# EAGLE schematic base-module-r1_MI_1 (EAGLE 5.12)
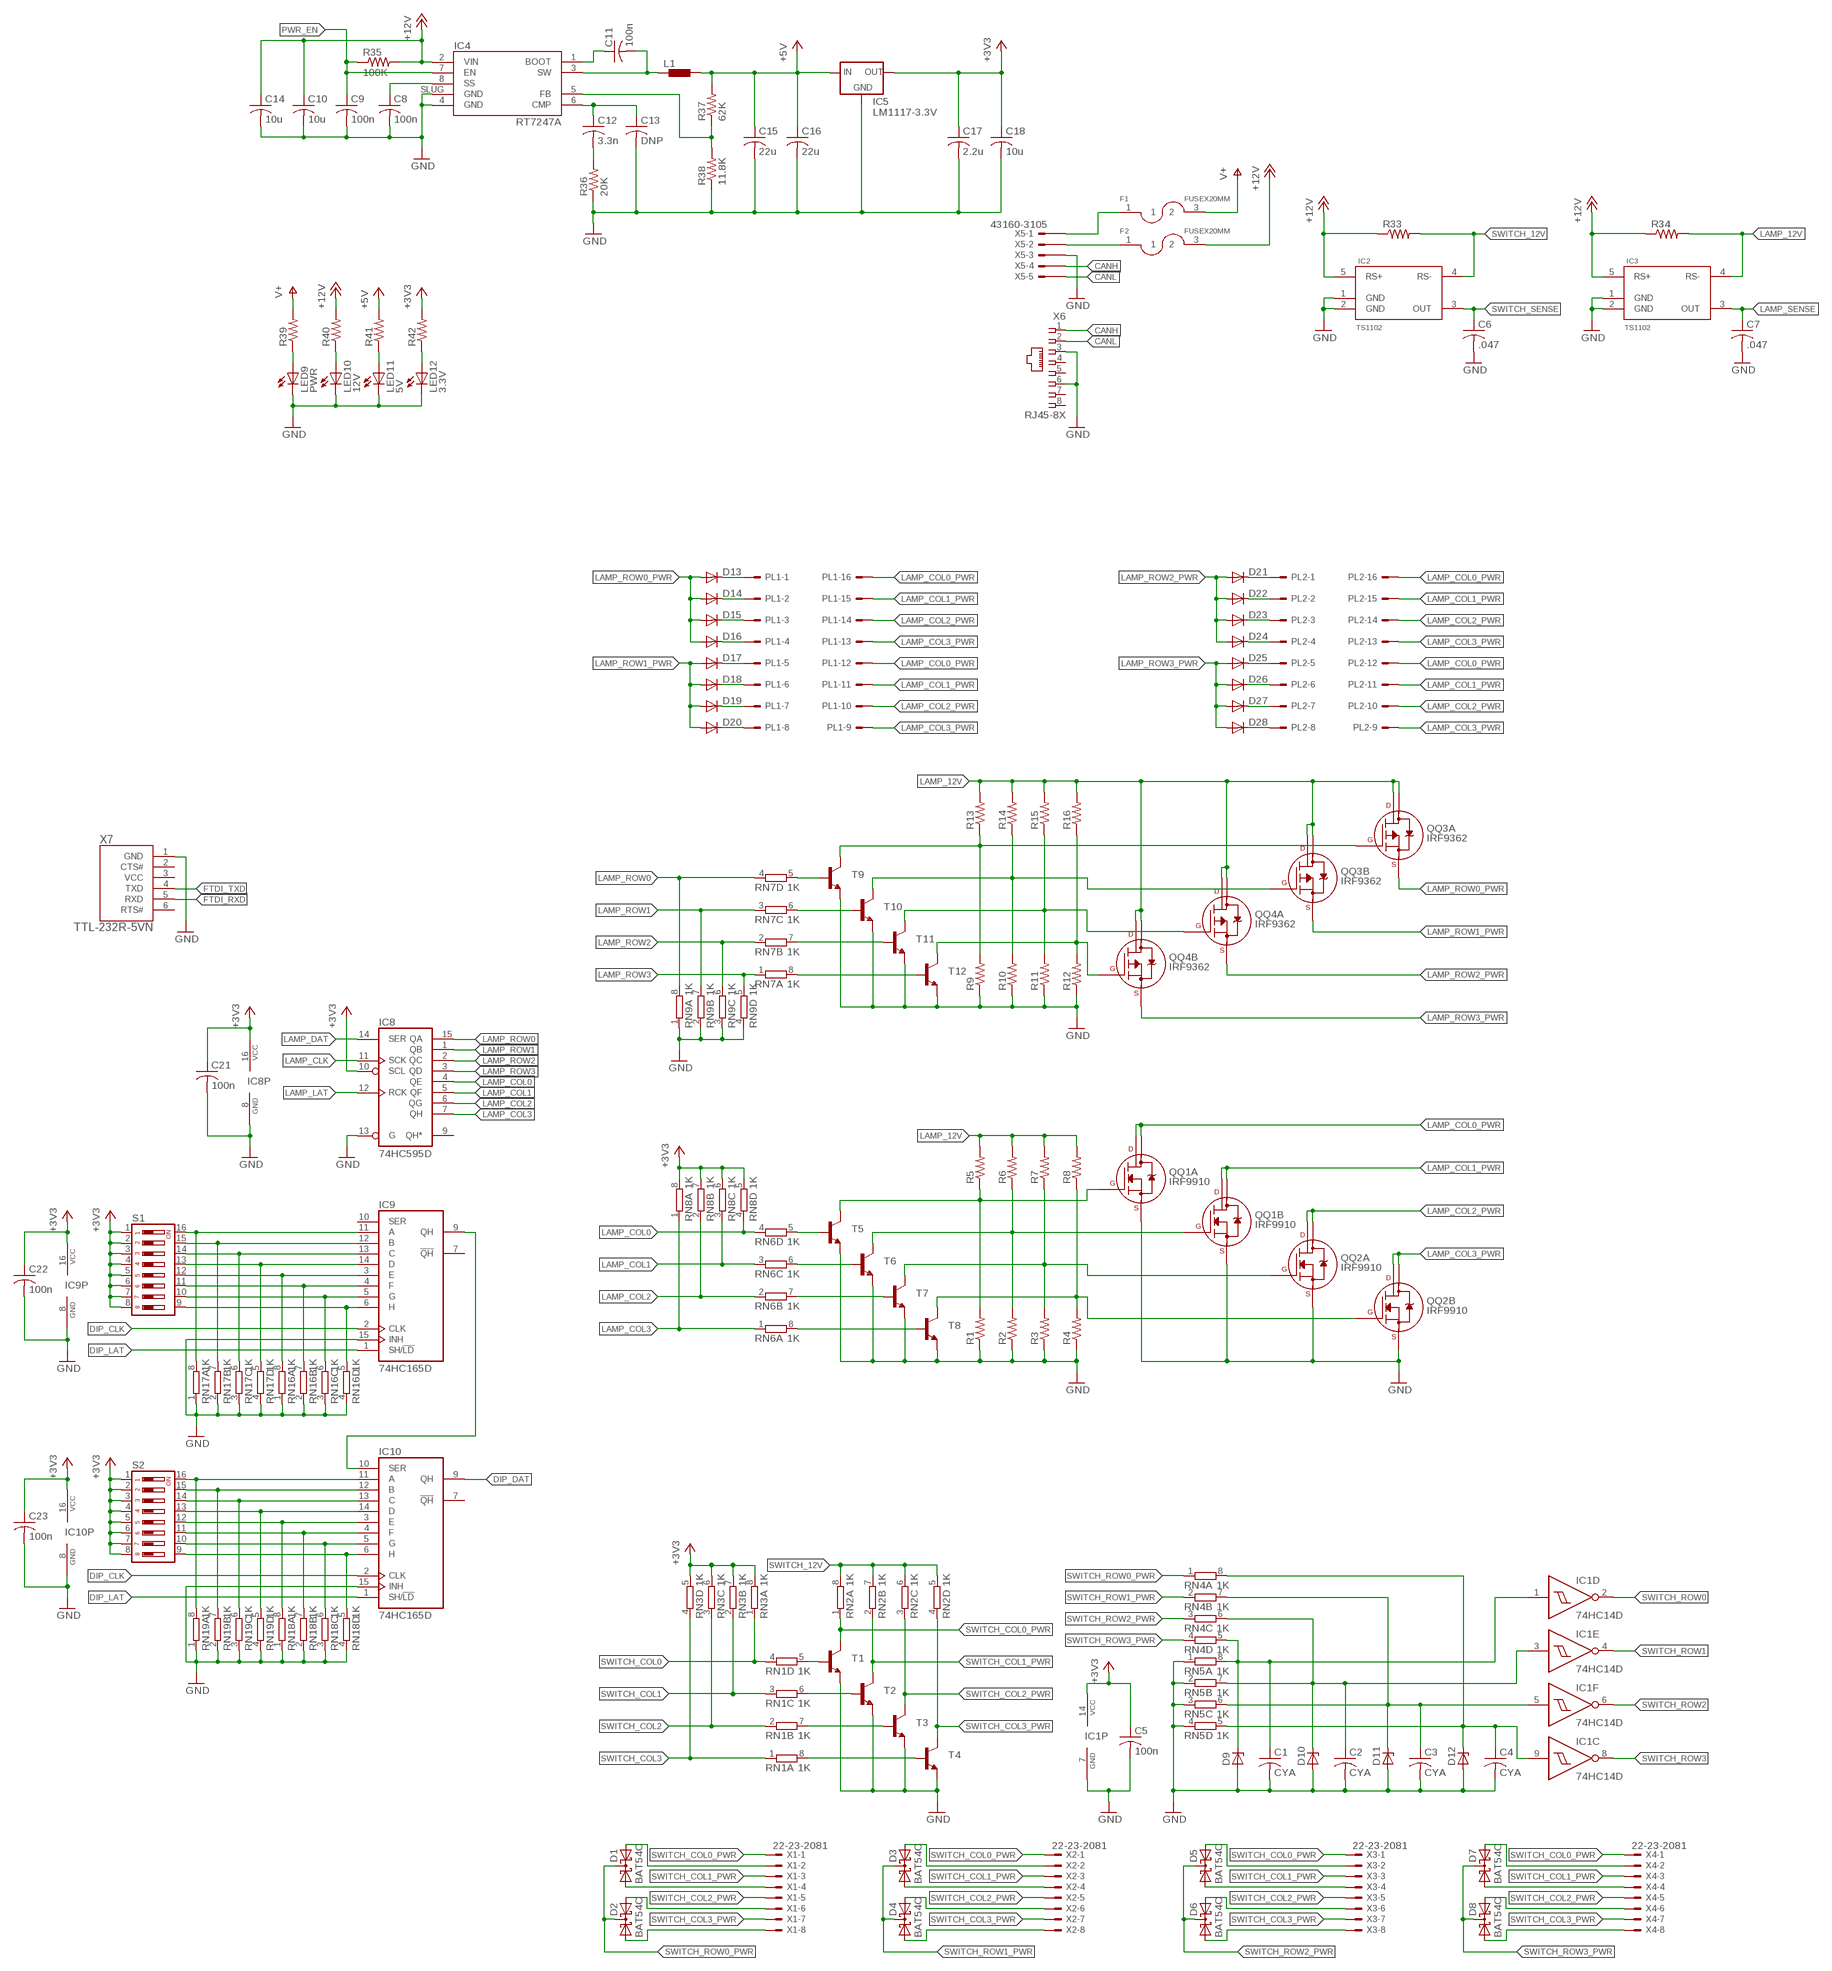
[diagram p0: schematic, sheet 1, part 1 of 3]
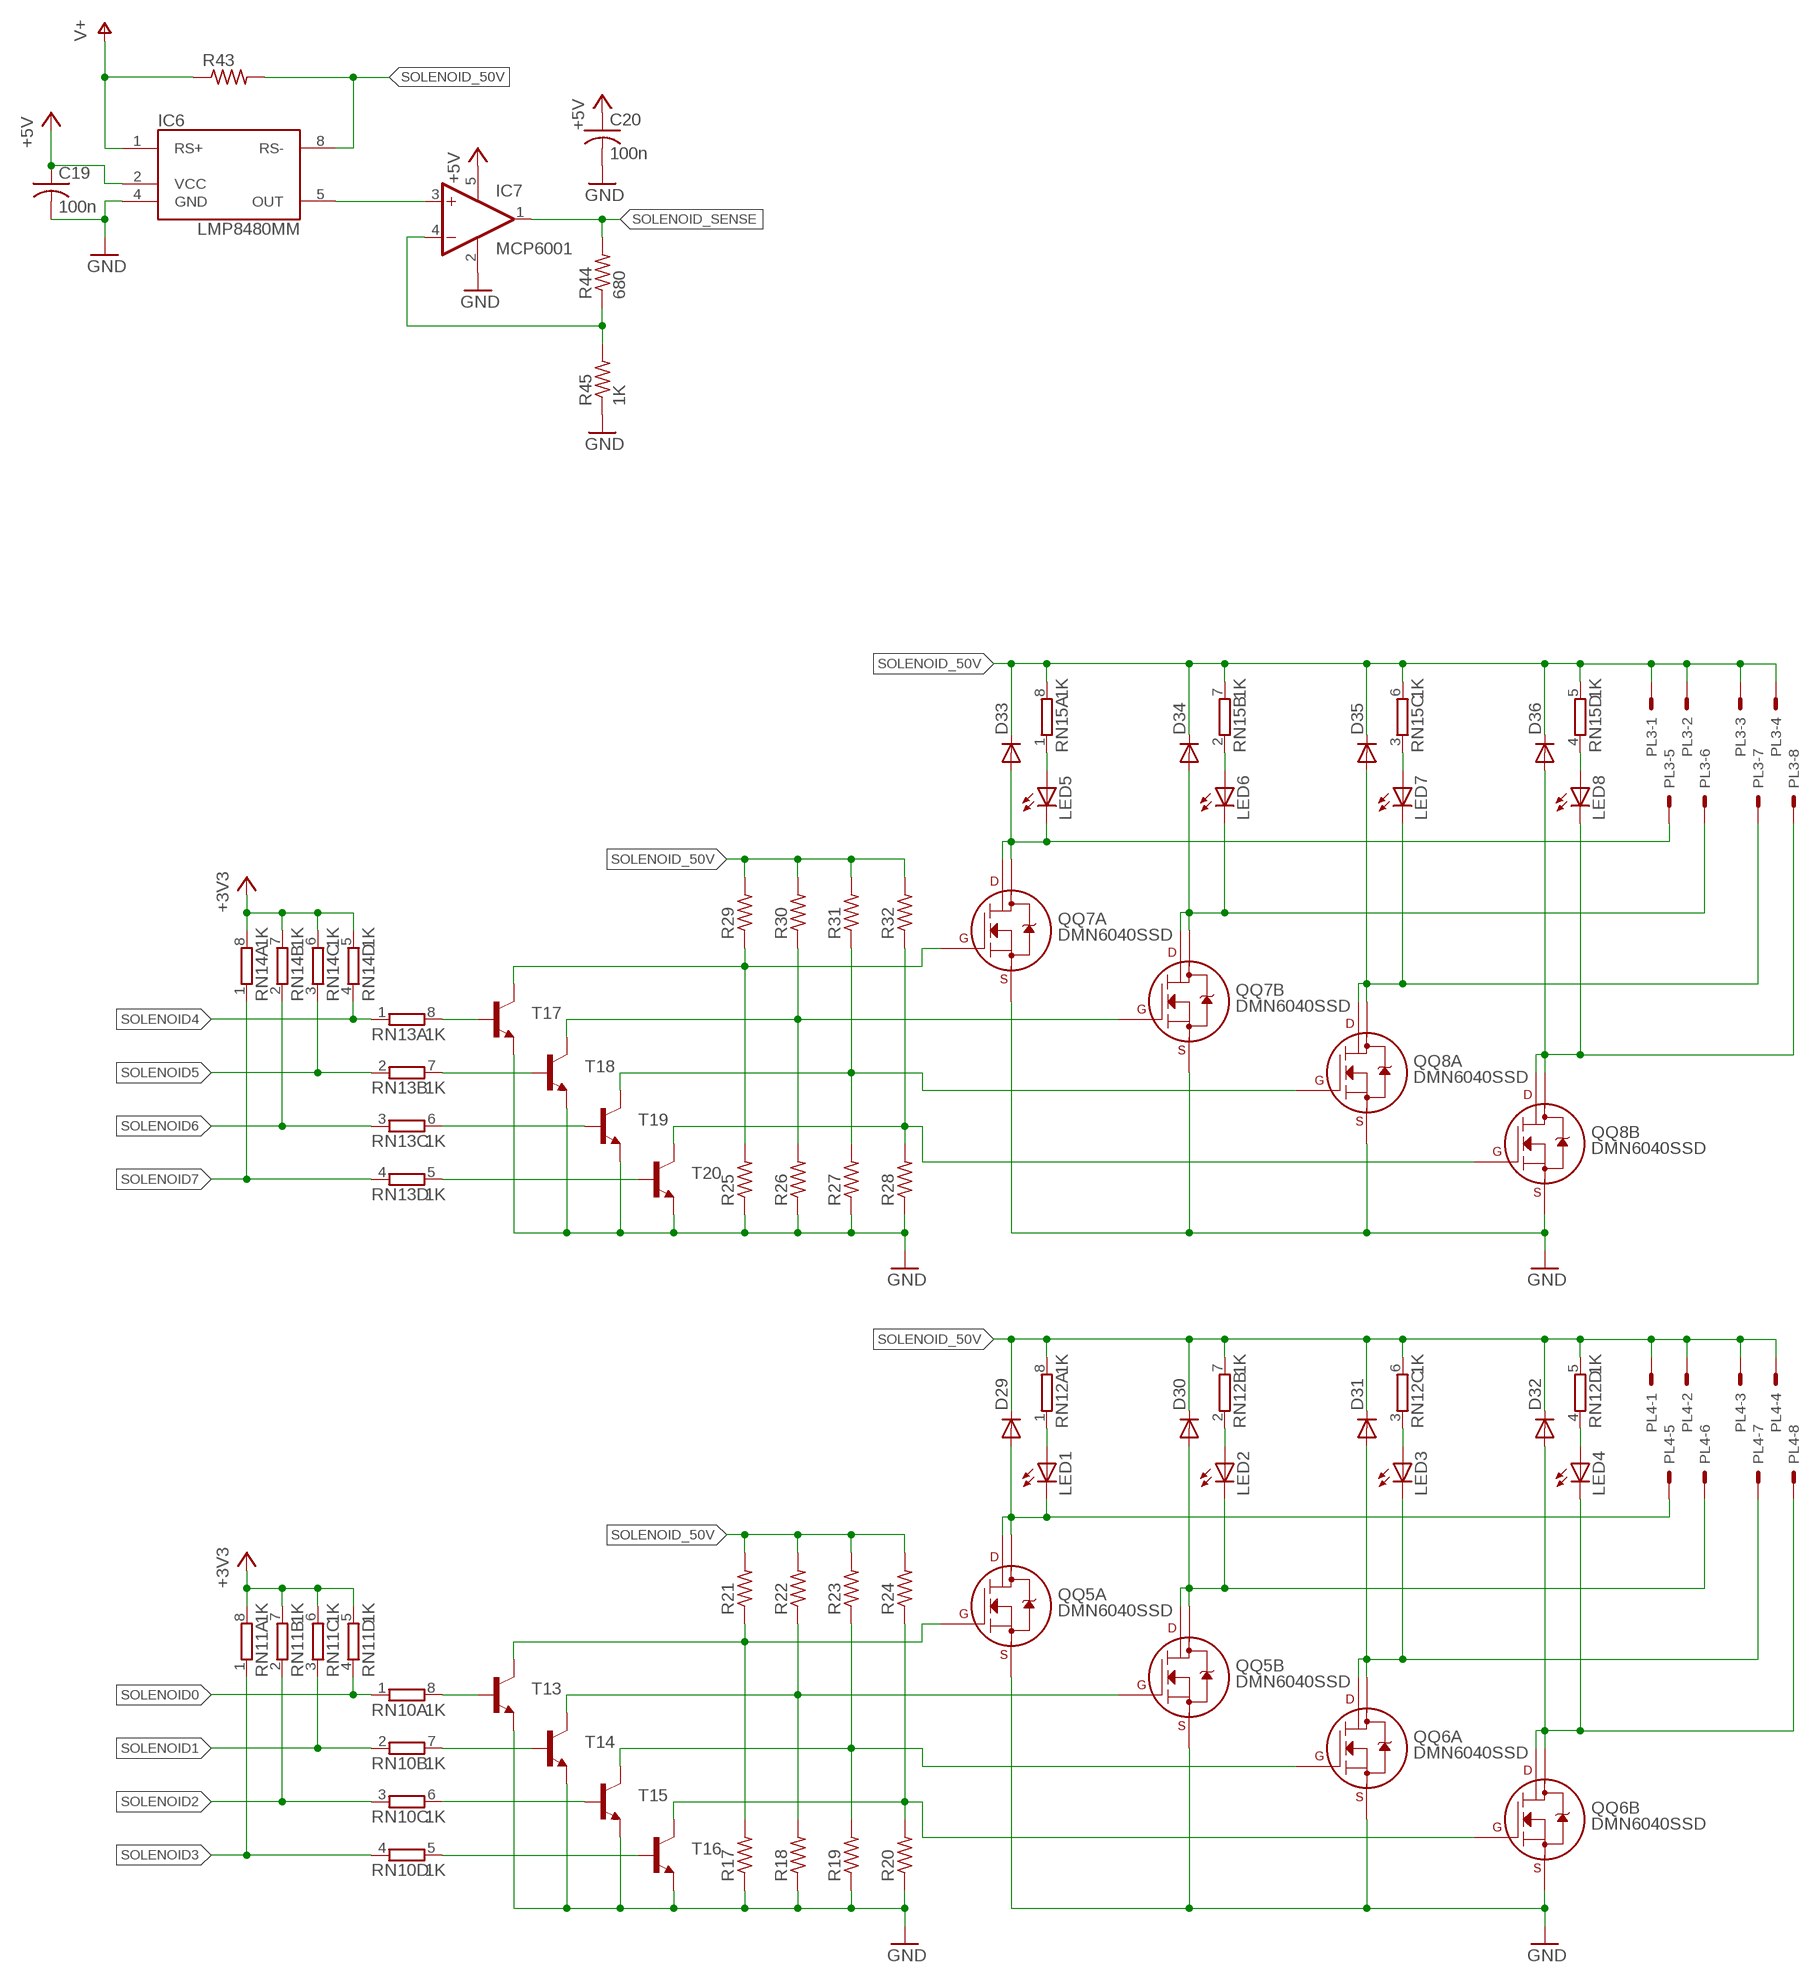
[diagram p1: schematic, sheet 1, part 2 of 3]
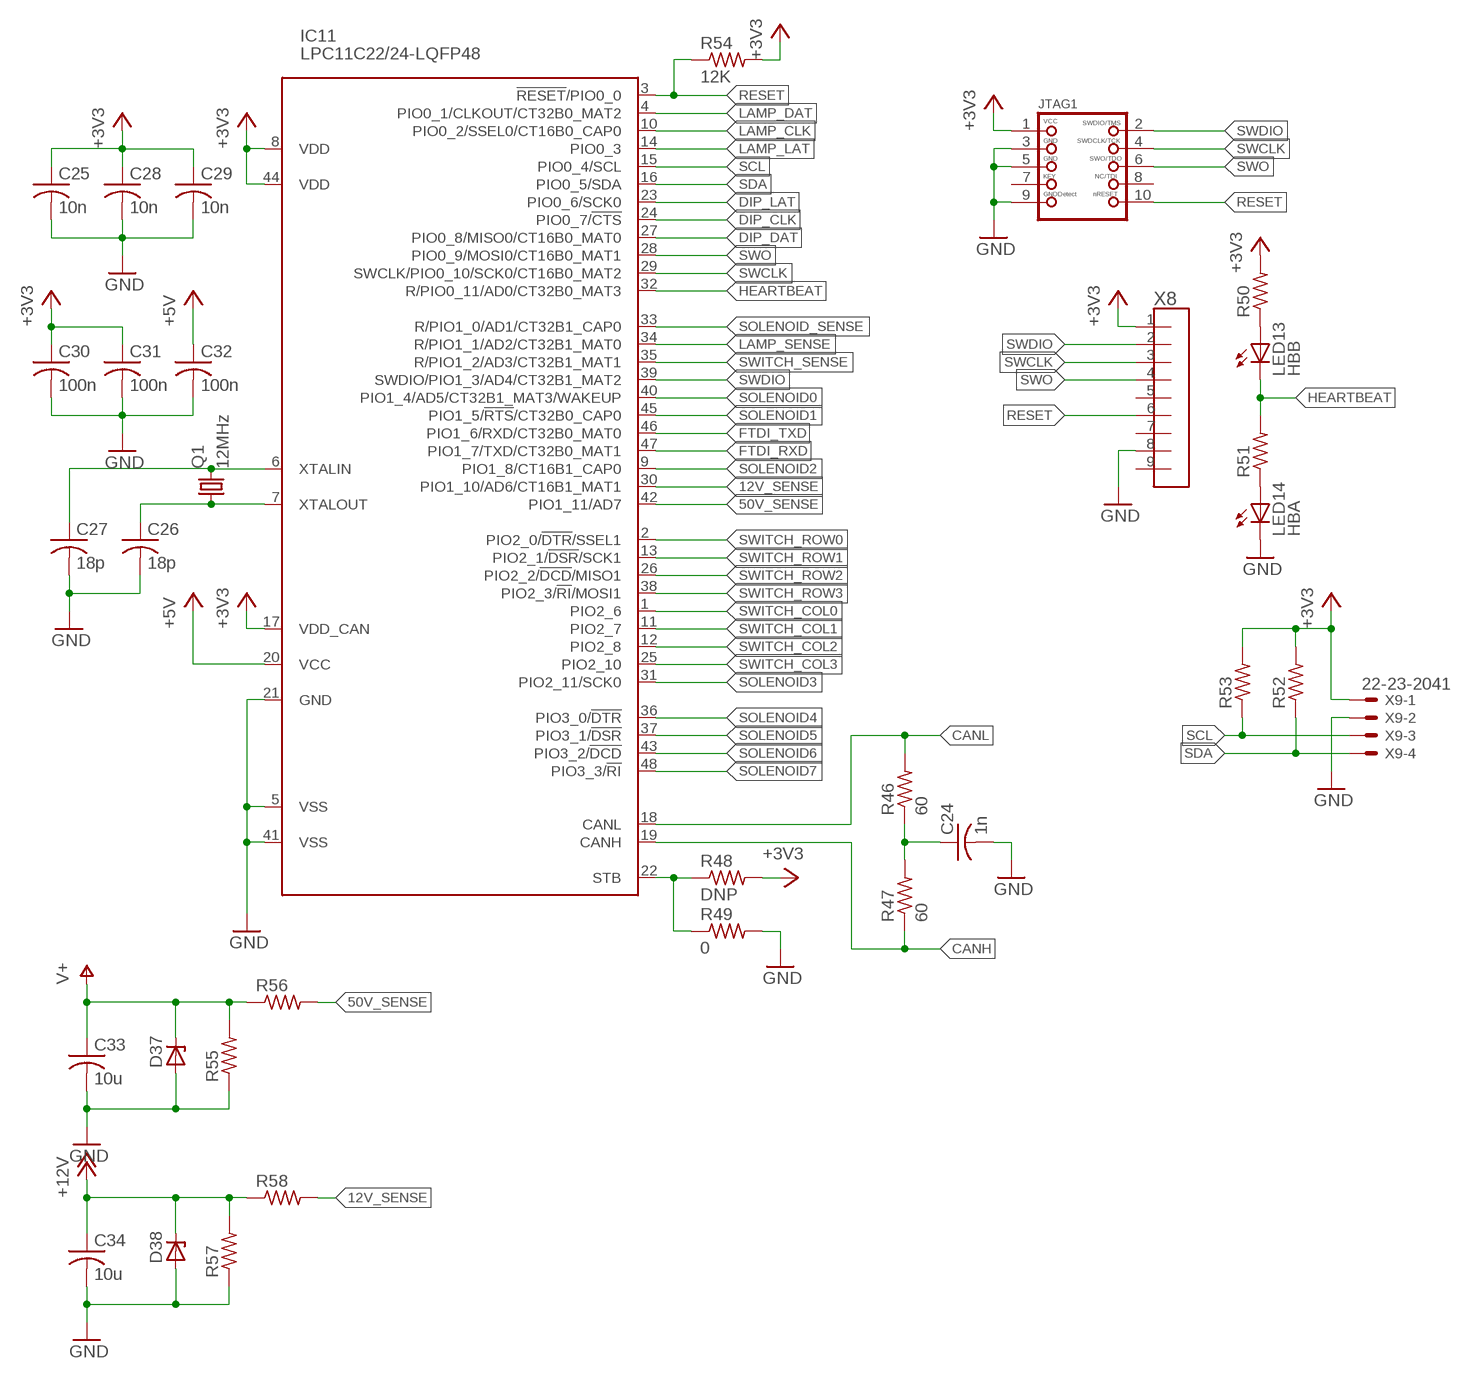
[diagram p2: schematic, sheet 1, part 3 of 3]

## Parts
C1  CYA  C-USC0603  [C0603]
C2  CYA  C-USC0603  [C0603]
C3  CYA  C-USC0603  [C0603]
C4  CYA  C-USC0603  [C0603]
C5  100n  C-USC0603  [C0603]
C6  .047  C-USC0805  [C0805]
C7  .047  C-USC0805  [C0805]
C8  100n  C-USC0805  [C0805]
C9  100n  C-USC0805  [C0805]
C10  10u  C-USC1206  [C1206]
C11  100n  C-USC0805  [C0805]
C12  3.3n  C-USC0805  [C0805]
C13  DNP  C-USC0805  [C0805]
C14  10u  C-USC1206  [C1206]
C15  22u  C-USC1206  [C1206]
C16  22u  C-USC1206  [C1206]
C17  2.2u  C-USC0805  [C0805]
C18  10u  C-USC1206  [C1206]
C19  100n  C-USC0805  [C0805]
C20  100n  C-USC0805  [C0805]
C21  100n  C-USC0603  [C0603]
C22  100n  C-USC0603  [C0603]
C23  100n  C-USC0603  [C0603]
C24  1n  C-USC0603  [C0603]
C25  10n  C-USC0603  [C0603]
C26  18p  C-USC0603  [C0603]
C27  18p  C-USC0603  [C0603]
C28  10n  C-USC0603  [C0603]
C29  10n  C-USC0603  [C0603]
C30  100n  C-USC0603  [C0603]
C31  100n  C-USC0603  [C0603]
C32  100n  C-USC0603  [C0603]
C33  10u  C-USC1206  [C1206]
C34  10u  C-USC1206  [C1206]
D1  BAT54C  [SOT23]
D2  BAT54C  [SOT23]
D3  BAT54C  [SOT23]
D4  BAT54C  [SOT23]
D5  BAT54C  [SOT23]
D6  BAT54C  [SOT23]
D7  BAT54C  [SOT23]
D8  BAT54C  [SOT23]
D9  ZENER-DIODESOD80C  [SOD80C]
D10  ZENER-DIODESOD80C  [SOD80C]
D11  ZENER-DIODESOD80C  [SOD80C]
D12  ZENER-DIODESOD80C  [SOD80C]
D13  DIODESMA  [SMA-DIODE]
D14  DIODESMA  [SMA-DIODE]
D15  DIODESMA  [SMA-DIODE]
D16  DIODESMA  [SMA-DIODE]
D17  DIODESMA  [SMA-DIODE]
D18  DIODESMA  [SMA-DIODE]
D19  DIODESMA  [SMA-DIODE]
D20  DIODESMA  [SMA-DIODE]
D21  DIODESMA  [SMA-DIODE]
D22  DIODESMA  [SMA-DIODE]
D23  DIODESMA  [SMA-DIODE]
D24  DIODESMA  [SMA-DIODE]
D25  DIODESMA  [SMA-DIODE]
D26  DIODESMA  [SMA-DIODE]
D27  DIODESMA  [SMA-DIODE]
D28  DIODESMA  [SMA-DIODE]
D29  DIODESMA  [SMA-DIODE]
D30  DIODESMA  [SMA-DIODE]
D31  DIODESMA  [SMA-DIODE]
D32  DIODESMA  [SMA-DIODE]
D33  DIODESMA  [SMA-DIODE]
D34  DIODESMA  [SMA-DIODE]
D35  DIODESMA  [SMA-DIODE]
D36  DIODESMA  [SMA-DIODE]
D37  ZENER-DIODESMB  [SMB]
D38  ZENER-DIODESMB  [SMB]
F1  FUSEX20MM  [FUSE_5MM]
F2  FUSEX20MM  [FUSE_5MM]
IC1  74HC14D  74LS14D  [SO14]
IC2  TS1102  MAX9938FEUK  [SOT23-5L]
IC3  TS1102  MAX9938FEUK  [SOT23-5L]
IC4  RT7247A  [SO08]
IC5  LM1117-3.3V  LM1117  [SOT223]
IC6  LMP8480MM  [MSOP-8]
IC7  MCP6001  MCP601OT  [SOT23-5]
IC8  74HC595D  74LS595D  [SO16]
IC9  74HC165D  74LS165D  [SO16]
IC10  74HC165D  74LS165D  [SO16]
IC11  LPC11C22/24-LQFP48  [LQFP48]
JTAG1  JTAG-CORTEXM3  [2X05_1.27MM_SMT]
L1  DR1030  [DR1030]
LED1  LEDCHIP-LED0805  [CHIP-LED0805]
LED2  LEDCHIP-LED0805  [CHIP-LED0805]
LED3  LEDCHIP-LED0805  [CHIP-LED0805]
LED4  LEDCHIP-LED0805  [CHIP-LED0805]
LED5  LEDCHIP-LED0805  [CHIP-LED0805]
LED6  LEDCHIP-LED0805  [CHIP-LED0805]
LED7  LEDCHIP-LED0805  [CHIP-LED0805]
LED8  LEDCHIP-LED0805  [CHIP-LED0805]
LED9  PWR  LEDCHIP-LED0805  [CHIP-LED0805]
LED10  12V  LEDCHIP-LED0805  [CHIP-LED0805]
LED11  5V  LEDCHIP-LED0805  [CHIP-LED0805]
LED12  3.3V  LEDCHIP-LED0805  [CHIP-LED0805]
LED13  HBB  LEDCHIP-LED0805  [CHIP-LED0805]
LED14  HBA  LEDCHIP-LED0805  [CHIP-LED0805]
PL1  555X-16V  [5566-16]
PL2  555X-16V  [5566-16]
PL3  555X-8V  [5566-8]
PL4  555X-8V  [5566-8]
Q1  12MHz  CRYSTALHC49UP  [HC49UP]
QQ1  IRF9910  IRF8910  [SO-8]
QQ2  IRF9910  IRF8910  [SO-8]
QQ3  IRF9362  [SO-8]
QQ4  IRF9362  [SO-8]
QQ5  DMN6040SSD  IRF8910  [SO-8]
QQ6  DMN6040SSD  IRF8910  [SO-8]
QQ7  DMN6040SSD  IRF8910  [SO-8]
QQ8  DMN6040SSD  IRF8910  [SO-8]
R1  R-US_R0805  [R0805]
R2  R-US_R0805  [R0805]
R3  R-US_R0805  [R0805]
R4  R-US_R0805  [R0805]
R5  R-US_R0805  [R0805]
R6  R-US_R0805  [R0805]
R7  R-US_R0805  [R0805]
R8  R-US_R0805  [R0805]
R9  R-US_R0805  [R0805]
R10  R-US_R0805  [R0805]
R11  R-US_R0805  [R0805]
R12  R-US_R0805  [R0805]
R13  R-US_R0805  [R0805]
R14  R-US_R0805  [R0805]
R15  R-US_R0805  [R0805]
R16  R-US_R0805  [R0805]
R17  R-US_R0805  [R0805]
R18  R-US_R0805  [R0805]
R19  R-US_R0805  [R0805]
R20  R-US_R0805  [R0805]
R21  R-US_R0805  [R0805]
R22  R-US_R0805  [R0805]
R23  R-US_R0805  [R0805]
R24  R-US_R0805  [R0805]
R25  R-US_R0805  [R0805]
R26  R-US_R0805  [R0805]
R27  R-US_R0805  [R0805]
R28  R-US_R0805  [R0805]
R29  R-US_R0805  [R0805]
R30  R-US_R0805  [R0805]
R31  R-US_R0805  [R0805]
R32  R-US_R0805  [R0805]
R33  R-US_M3516  [M3516]
R34  R-US_M3516  [M3516]
R35  100K  R-US_R0805  [R0805]
R36  20K  R-US_R0805  [R0805]
R37  62K  R-US_R0805  [R0805]
R38  11.8K  R-US_R0805  [R0805]
R39  R-US_R0805  [R0805]
R40  R-US_R0805  [R0805]
R41  R-US_R0805  [R0805]
R42  R-US_R0805  [R0805]
R43  R-US_M3516  [M3516]
R44  680  R-US_R0805  [R0805]
R45  1K  R-US_R0805  [R0805]
R46  60  R-US_R0805  [R0805]
R47  60  R-US_R0805  [R0805]
R48  DNP  R-US_R0805  [R0805]
R49  0  R-US_R0805  [R0805]
R50  R-US_R0805  [R0805]
R51  R-US_R0805  [R0805]
R52  R-US_R0805  [R0805]
R53  R-US_R0805  [R0805]
R54  12K  R-US_R0805  [R0805]
R55  R-US_R0805  [R0805]
R56  R-US_R0805  [R0805]
R57  R-US_R0805  [R0805]
R58  R-US_R0805  [R0805]
RN1  1K  4R-NEXBS8V  [EXBS8V]
RN2  1K  4R-NEXBS8V  [EXBS8V]
RN3  1K  4R-NEXBS8V  [EXBS8V]
RN4  1K  4R-NEXBS8V  [EXBS8V]
RN5  1K  4R-NEXBS8V  [EXBS8V]
RN6  1K  4R-NEXBS8V  [EXBS8V]
RN7  1K  4R-NEXBS8V  [EXBS8V]
RN8  1K  4R-NEXBS8V  [EXBS8V]
RN9  1K  4R-NEXBS8V  [EXBS8V]
RN10  1K  4R-NEXBS8V  [EXBS8V]
RN11  1K  4R-NEXBS8V  [EXBS8V]
RN12  1K  4R-NEXBS8V  [EXBS8V]
RN13  1K  4R-NEXBS8V  [EXBS8V]
RN14  1K  4R-NEXBS8V  [EXBS8V]
RN15  1K  4R-NEXBS8V  [EXBS8V]
RN16  1K  4R-NEXBS8V  [EXBS8V]
RN17  1K  4R-NEXBS8V  [EXBS8V]
RN18  1K  4R-NEXBS8V  [EXBS8V]
RN19  1K  4R-NEXBS8V  [EXBS8V]
S1  DS08  [DS-08]
S2  DS08  [DS-08]
T1  MMBT3904LT1-NPN-SOT23-BEC  [SOT23-BEC]
T2  MMBT3904LT1-NPN-SOT23-BEC  [SOT23-BEC]
T3  MMBT3904LT1-NPN-SOT23-BEC  [SOT23-BEC]
T4  MMBT3904LT1-NPN-SOT23-BEC  [SOT23-BEC]
T5  MMBT3904LT1-NPN-SOT23-BEC  [SOT23-BEC]
T6  MMBT3904LT1-NPN-SOT23-BEC  [SOT23-BEC]
T7  MMBT3904LT1-NPN-SOT23-BEC  [SOT23-BEC]
T8  MMBT3904LT1-NPN-SOT23-BEC  [SOT23-BEC]
T9  MMBT3904LT1-NPN-SOT23-BEC  [SOT23-BEC]
T10  MMBT3904LT1-NPN-SOT23-BEC  [SOT23-BEC]
T11  MMBT3904LT1-NPN-SOT23-BEC  [SOT23-BEC]
T12  MMBT3904LT1-NPN-SOT23-BEC  [SOT23-BEC]
T13  MMBT3904LT1-NPN-SOT23-BEC  [SOT23-BEC]
T14  MMBT3904LT1-NPN-SOT23-BEC  [SOT23-BEC]
T15  MMBT3904LT1-NPN-SOT23-BEC  [SOT23-BEC]
T16  MMBT3904LT1-NPN-SOT23-BEC  [SOT23-BEC]
T17  MMBT3904LT1-NPN-SOT23-BEC  [SOT23-BEC]
T18  MMBT3904LT1-NPN-SOT23-BEC  [SOT23-BEC]
T19  MMBT3904LT1-NPN-SOT23-BEC  [SOT23-BEC]
T20  MMBT3904LT1-NPN-SOT23-BEC  [SOT23-BEC]
X1  22-23-2081  [22-23-2081]
X2  22-23-2081  [22-23-2081]
X3  22-23-2081  [22-23-2081]
X4  22-23-2081  [22-23-2081]
X5  43160-3105  [43160-XX05]
X6  RJ45-8X  [RJ45-NO-SHIELD]
X7  TTL-232R-5VN  [USBCABLE-0.100-NOLBL]
X8  M09-100MIL  [100MIL-9]
X9  22-23-2041  [22-23-2041]

## Nets
12V_SENSE: IC11.30(PIO1_10/AD6/CT16B1_MAT1) R58.2
50V_SENSE: IC11.42(PIO1_11/AD7) R56.2
+3V3: C5.1 C17.1 C18.1 C21.1 C22.1 C23.1 C25.1 C28.1 C29.1 C30.1 C31.1 IC1.14(P:VCC) IC5.2(OUT) IC8.10(SCL) IC8.16(VCC) IC9.16(VCC) IC10.16(VCC) IC11.8(VDD) IC11.17(VDD_CAN) IC11.44(VDD) JTAG1.1 R42.2 R48.2 R50.2 R52.2 R53.2 R54.2 RN3.5 RN3.6 RN3.7 RN3.8 RN8.5 RN8.6 RN8.7 RN8.8 RN11.5 RN11.6 RN11.7 RN11.8 RN14.5 RN14.6 RN14.7 RN14.8 S1.1 S1.2 S1.3 S1.4 S1.5 S1.6 S1.7 S1.8 S2.1 S2.2 S2.3 S2.4 S2.5 S2.6 S2.7 S2.8 X8.1 X9.1
+5V: C15.1 C16.1 C19.1 C20.1 C32.1 IC5.3(IN) IC6.2(VCC) IC7.5(V+) IC11.20(VCC) L1.2 R37.2 R41.2
+12V: C10.1 C14.1 C34.1 D38.C F2.3 IC2.5(RS+) IC3.5(RS+) IC4.2(VIN) R33.1 R34.1 R35.2 R40.2 R57.2 R58.1
CANH: IC11.19(CANH) R47.1 X5.4@1(-4:S) X6.1
CANL: IC11.18(CANL) R46.2 X5.5@1(-5:S) X6.2
DIP_CLK: IC9.2(CLK) IC10.2(CLK) IC11.24(PIO0_7/!CTS!)
DIP_DAT: IC10.9(QH) IC11.27(PIO0_8/MISO0/CT16B0_MAT0)
DIP_LAT: IC9.1(SH/!LD) IC10.1(SH/!LD) IC11.23(PIO0_6/SCK0)
FTDI_RXD: IC11.47(PIO1_7/TXD/CT32B0_MAT1) X7.5(RXD)
FTDI_TXD: IC11.46(PIO1_6/RXD/CT32B0_MAT0) X7.4(TXD)
GND: C1.2 C2.2 C3.2 C4.2 C5.2 C6.2 C7.2 C8.2 C9.2 C10.2 C13.2 C14.2 C15.2 C16.2 C17.2 C18.2 C19.2 C20.2 C21.2 C22.2 C23.2 C24.2 C25.2 C26.2 C27.2 C28.2 C29.2 C30.2 C31.2 C32.2 C33.2 C34.2 D9.A D10.A D11.A D12.A D37.A D38.A IC1.7(P:GND) IC2.1(GND) IC2.2(GND) IC3.1(GND) IC3.2(GND) IC4.4(GND) IC4.SLUG(GND) IC5.1(GND) IC6.4(GND) IC7.2(V-) IC8.8(GND) IC8.13(G) IC9.8(GND) IC9.15(INH) IC10.8(GND) IC10.15(INH) IC11.5(VSS) IC11.21(GND) IC11.41(VSS) JTAG1.3 JTAG1.5 JTAG1.9 LED9.C LED10.C LED11.C LED12.C LED14.C QQ1.1(A:S) QQ1.3(B:S) QQ2.1(A:S) QQ2.3(B:S) QQ5.1(A:S) QQ5.3(B:S) QQ6.1(A:S) QQ6.3(B:S) QQ7.1(A:S) QQ7.3(B:S) QQ8.1(A:S) QQ8.3(B:S) R1.1 R2.1 R3.1 R4.1 R9.1 R10.1 R11.1 R12.1 R17.1 R18.1 R19.1 R20.1 R25.1 R26.1 R27.1 R28.1 R36.1 R38.1 R45.1 R49.2 R55.1 R57.1 RN5.1 RN5.2 RN5.3 RN5.4 RN9.1 RN9.2 RN9.3 RN9.4 RN16.1 RN16.2 RN16.3 RN16.4 RN17.1 RN17.2 RN17.3 RN17.4 RN18.1 RN18.2 RN18.3 RN18.4 RN19.1 RN19.2 RN19.3 RN19.4 T1.E T2.E T3.E T4.E T5.E T6.E T7.E T8.E T9.E T10.E T11.E T12.E T13.E T14.E T15.E T16.E T17.E T18.E T19.E T20.E X5.3@1(-3:S) X6.3 X6.6 X7.1(GND) X8.8 X9.2
HEARTBEAT: IC11.32(R/PIO0_11/AD0/CT32B0_MAT3) LED13.C R51.2
LAMP_12V: IC3.4(RS-) QQ3.5(B:D1) QQ3.6(B:D2) QQ3.7(A:D2) QQ3.8(A:D1) QQ4.5(B:D1) QQ4.6(B:D2) QQ4.7(A:D2) QQ4.8(A:D1) R5.2 R6.2 R7.2 R8.2 R13.2 R14.2 R15.2 R16.2 R34.2
LAMP_CLK: IC8.11(SCK) IC11.10(PIO0_2/SSEL0/CT16B0_CAP0)
LAMP_COL0: IC8.4(QE) RN6.4 RN8.4
LAMP_COL0_PWR: PL1.12 PL1.16 PL2.12 PL2.16 QQ1.7(A:D2) QQ1.8(A:D1)
LAMP_COL1: IC8.5(QF) RN6.3 RN8.3
LAMP_COL1_PWR: PL1.11 PL1.15 PL2.11 PL2.15 QQ1.5(B:D2) QQ1.6(B:D1)
LAMP_COL2: IC8.6(QG) RN6.2 RN8.2
LAMP_COL2_PWR: PL1.10 PL1.14 PL2.10 PL2.14 QQ2.7(A:D2) QQ2.8(A:D1)
LAMP_COL3: IC8.7(QH) RN6.1 RN8.1
LAMP_COL3_PWR: PL1.9 PL1.13 PL2.9 PL2.13 QQ2.5(B:D2) QQ2.6(B:D1)
LAMP_DAT: IC8.14(SER) IC11.4(PIO0_1/CLKOUT/CT32B0_MAT2)
LAMP_LAT: IC8.12(RCK) IC11.14(PIO0_3)
LAMP_ROW0: IC8.15(QA) RN7.4 RN9.8
LAMP_ROW0_PWR: D13.A D14.A D15.A D16.A QQ3.1(A:S1)
LAMP_ROW1: IC8.1(QB) RN7.3 RN9.7
LAMP_ROW1_PWR: D17.A D18.A D19.A D20.A QQ3.3(B:S1)
LAMP_ROW2: IC8.2(QC) RN7.2 RN9.6
LAMP_ROW2_PWR: D21.A D22.A D23.A D24.A QQ4.1(A:S1)
LAMP_ROW3: IC8.3(QD) RN7.1 RN9.5
LAMP_ROW3_PWR: D25.A D26.A D27.A D28.A QQ4.3(B:S1)
LAMP_SENSE: C7.1 IC3.3(OUT) IC11.34(R/PIO1_1/AD2/CT32B1_MAT0)
N$1: D2.2(A2) X1.6
N$2: RN1.8 T4.B
N$3: RN1.7 T3.B
N$4: RN1.6 T2.B
N$5: RN1.5 T1.B
N$6: D1.1(A1) X1.4
N$7: D1.2(A2) X1.2
N$8: D2.1(A1) X1.8
N$9: C1.1 D9.C IC1.1(D:I) RN4.5 RN5.8
N$10: D4.2(A2) X2.6
N$11: D3.1(A1) X2.4
N$12: D3.2(A2) X2.2
N$13: D4.1(A1) X2.8
N$14: RN6.5 T5.B
N$15: D6.2(A2) X3.6
N$16: D5.1(A1) X3.4
N$17: D5.2(A2) X3.2
N$18: D6.1(A1) X3.8
N$19: C2.1 D10.C IC1.3(E:I) RN4.6 RN5.7
N$20: D8.2(A2) X4.6
N$21: D7.1(A1) X4.4
N$22: D7.2(A2) X4.2
N$23: D8.1(A1) X4.8
N$24: C3.1 D11.C IC1.5(F:I) RN4.7 RN5.6
N$25: C4.1 D12.C IC1.9(C:I) RN4.8 RN5.5
N$26: RN6.6 T6.B
N$27: RN6.7 T7.B
N$28: QQ1.2(A:G) R1.2 R5.1 T5.C
N$29: QQ1.4(B:G) R2.2 R6.1 T6.C
N$30: QQ2.2(A:G) R3.2 R7.1 T7.C
N$31: QQ2.4(B:G) R4.2 R8.1 T8.C
N$32: RN6.8 T8.B
N$33: QQ3.2(A:G1) R9.2 R13.1 T9.C
N$34: QQ3.4(B:G1) R10.2 R14.1 T10.C
N$35: QQ4.2(A:G1) R11.2 R15.1 T11.C
N$36: QQ4.4(B:G1) R12.2 R16.1 T12.C
N$37: RN7.5 T9.B
N$38: RN7.6 T10.B
N$39: RN7.7 T11.B
N$40: RN7.8 T12.B
N$41: D13.C PL1.1
N$42: D14.C PL1.2
N$43: D15.C PL1.3
N$44: D16.C PL1.4
N$45: D17.C PL1.5
N$46: D18.C PL1.6
N$47: D19.C PL1.7
N$48: D20.C PL1.8
N$49: QQ5.2(A:G) R17.2 R21.1 T13.C
N$50: QQ5.4(B:G) R18.2 R22.1 T14.C
N$51: D21.C PL2.1
N$52: D22.C PL2.2
N$53: D23.C PL2.3
N$54: D24.C PL2.4
N$55: D25.C PL2.5
N$56: D26.C PL2.6
N$57: D27.C PL2.7
N$58: D28.C PL2.8
N$59: QQ6.2(A:G) R19.2 R23.1 T15.C
N$60: QQ6.4(B:G) R20.2 R24.1 T16.C
N$61: RN10.8 T13.B
N$62: RN10.7 T14.B
N$63: RN10.6 T15.B
N$64: RN10.5 T16.B
N$65: D29.A LED1.C PL4.5 QQ5.7(A:D2) QQ5.8(A:D1)
N$66: D30.A LED2.C PL4.6 QQ5.5(B:D2) QQ5.6(B:D1)
N$67: D31.A LED3.C PL4.7 QQ6.7(A:D2) QQ6.8(A:D1)
N$68: D32.A LED4.C PL4.8 QQ6.5(B:D2) QQ6.6(B:D1)
N$69: F2.1 X5.2@1(-2:S)
N$70: LED4.A RN12.4
N$71: LED3.A RN12.3
N$72: LED2.A RN12.2
N$73: LED1.A RN12.1
N$74: QQ7.2(A:G) R25.2 R29.1 T17.C
N$75: QQ7.4(B:G) R26.2 R30.1 T18.C
N$76: QQ8.2(A:G) R27.2 R31.1 T19.C
N$77: QQ8.4(B:G) R28.2 R32.1 T20.C
N$78: RN13.8 T17.B
N$79: RN13.7 T18.B
N$80: RN13.6 T19.B
N$81: RN13.5 T20.B
N$82: D33.A LED5.C PL3.5 QQ7.7(A:D2) QQ7.8(A:D1)
N$83: D34.A LED6.C PL3.6 QQ7.5(B:D2) QQ7.6(B:D1)
N$84: D35.A LED7.C PL3.7 QQ8.7(A:D2) QQ8.8(A:D1)
N$85: D36.A LED8.C PL3.8 QQ8.5(B:D2) QQ8.6(B:D1)
N$86: LED8.A RN15.4
N$87: LED7.A RN15.3
N$88: LED6.A RN15.2
N$89: LED5.A RN15.1
N$90: F1.1 X5.1@1(-1:S)
N$91: LED10.A R40.1
N$92: C8.1 IC4.8(SS)
N$93: IC7.4(-IN) R44.1 R45.2
N$94: LED9.A R39.1
N$95: C11.1 IC4.1(BOOT)
N$96: C11.2 IC4.3(SW) L1.1
N$97: C12.1 C13.1 IC4.6(CMP)
N$98: C12.2 R36.2
N$99: IC4.5(FB) R37.1 R38.2
N$100: LED11.A R41.1
N$101: LED12.A R42.1
N$102: IC6.5(OUT) IC7.3(+IN)
N$103: IC11.22(STB) R48.1 R49.1
N$104: IC9.6(H) RN16.5 S1.9
N$105: IC9.5(G) RN16.6 S1.10
N$106: IC9.4(F) RN16.7 S1.11
N$107: IC9.3(E) RN16.8 S1.12
N$108: IC9.14(D) RN17.5 S1.13
N$109: IC9.13(C) RN17.6 S1.14
N$110: IC9.12(B) RN17.7 S1.15
N$111: IC9.11(A) RN17.8 S1.16
N$112: IC10.6(H) RN18.5 S2.9
N$113: IC10.5(G) RN18.6 S2.10
N$114: IC10.4(F) RN18.7 S2.11
N$115: IC10.3(E) RN18.8 S2.12
N$116: IC10.14(D) RN19.5 S2.13
N$117: IC10.13(C) RN19.6 S2.14
N$118: IC10.12(B) RN19.7 S2.15
N$119: IC10.11(A) RN19.8 S2.16
N$120: IC9.9(QH) IC10.10(SER)
N$121: C26.1 IC11.7(XTALOUT) Q1.1
N$122: C24.1 R46.1 R47.2
N$123: C27.1 IC11.6(XTALIN) Q1.2
N$126: LED13.A R50.1
N$127: LED14.A R51.1
PWR_EN: C9.1 IC4.7(EN) R35.1
RESET: IC11.3(!RESET!/PIO0_0) JTAG1.10 R54.1 X8.6
SCL: IC11.15(PIO0_4/SCL) R53.1 X9.3
SDA: IC11.16(PIO0_5/SDA) R52.1 X9.4
SOLENOID0: IC11.40(PIO1_4/AD5/CT32B1_MAT3/WAKEUP) RN10.1 RN11.4
SOLENOID1: IC11.45(PIO1_5/!RTS!/CT32B0_CAP0) RN10.2 RN11.3
SOLENOID2: IC11.9(PIO1_8/CT16B1_CAP0) RN10.3 RN11.2
SOLENOID3: IC11.31(PIO2_11/SCK0) RN10.4 RN11.1
SOLENOID4: IC11.36(PIO3_0/!DTR!) RN13.1 RN14.4
SOLENOID5: IC11.37(PIO3_1/!DSR!) RN13.2 RN14.3
SOLENOID6: IC11.43(PIO3_2/!DCD!) RN13.3 RN14.2
SOLENOID7: IC11.48(PIO3_3/!RI!) RN13.4 RN14.1
SOLENOID_50V: D29.C D30.C D31.C D32.C D33.C D34.C D35.C D36.C IC6.8(RS-) PL3.1 PL3.2 PL3.3 PL3.4 PL4.1 PL4.2 PL4.3 PL4.4 R21.2 R22.2 R23.2 R24.2 R29.2 R30.2 R31.2 R32.2 R43.2 RN12.5 RN12.6 RN12.7 RN12.8 RN15.5 RN15.6 RN15.7 RN15.8
SOLENOID_SENSE: IC7.1(OUT) IC11.33(R/PIO1_0/AD1/CT32B1_CAP0) R44.2
SWCLK: IC11.29(SWCLK/PIO0_10/SCK0/CT16B0_MAT2) JTAG1.4 X8.3
SWDIO: IC11.39(SWDIO/PIO1_3/AD4/CT32B1_MAT2) JTAG1.2 X8.2
SWITCH_12V: IC2.4(RS-) R33.2 RN2.5 RN2.6 RN2.7 RN2.8
SWITCH_COL0: IC11.1(PIO2_6) RN1.4 RN3.1
SWITCH_COL0_PWR: RN2.1 T1.C X1.1 X2.1 X3.1 X4.1
SWITCH_COL1: IC11.11(PIO2_7) RN1.3 RN3.2
SWITCH_COL1_PWR: RN2.2 T2.C X1.3 X2.3 X3.3 X4.3
SWITCH_COL2: IC11.12(PIO2_8) RN1.2 RN3.3
SWITCH_COL2_PWR: RN2.3 T3.C X1.5 X2.5 X3.5 X4.5
SWITCH_COL3: IC11.25(PIO2_10) RN1.1 RN3.4
SWITCH_COL3_PWR: RN2.4 T4.C X1.7 X2.7 X3.7 X4.7
SWITCH_ROW0: IC1.2(D:O) IC11.2(PIO2_0/!DTR!/SSEL1)
SWITCH_ROW0_PWR: D1.3(CC) D2.3(CC) RN4.1
SWITCH_ROW1: IC1.4(E:O) IC11.13(PIO2_1/!DSR!/SCK1)
SWITCH_ROW1_PWR: D3.3(CC) D4.3(CC) RN4.2
SWITCH_ROW2: IC1.6(F:O) IC11.26(PIO2_2/!DCD!/MISO1)
SWITCH_ROW2_PWR: D5.3(CC) D6.3(CC) RN4.3
SWITCH_ROW3: IC1.8(C:O) IC11.38(PIO2_3/!RI!/MOSI1)
SWITCH_ROW3_PWR: D7.3(CC) D8.3(CC) RN4.4
SWITCH_SENSE: C6.1 IC2.3(OUT) IC11.35(R/PIO1_2/AD3/CT32B1_MAT1)
SWO: IC11.28(PIO0_9/MOSI0/CT16B0_MAT1) JTAG1.6 X8.4
V+: C33.1 D37.C F1.3 IC6.1(RS+) R39.2 R43.1 R55.2 R56.1
Unconnected: IC1.10(B:O) IC1.11(B:I) IC1.12(A:O) IC1.13(A:I) IC8.9(QH*) IC9.7(!QH) IC9.10(SER) IC10.7(!QH) JTAG1.7 JTAG1.8 X5.1@2(-1:S) X5.2@2(-2:S) X5.3@2(-3:S) X5.4@2(-4:S) X5.5@2(-5:S) X6.4 X6.5 X6.7 X6.8 X7.2(CTS#) X7.3(VCC) X7.6(RTS#) X8.5 X8.7 X8.9

## Library data of the parts
C1-C34 = rcl:C-US: CAPACITOR, American symbol
D1-D8 = diode:BAT54C: Schottky Diodes Source: Fairchild .. BAT54.pdf
D9-D12 D37 D38 = diode:ZENER-DIODE: Z-Diode
D13-D36 = SparkFun:DIODE: Diode These are standard reverse protection diodes and small signal diodes. SMA package can handle up to about 1A. SOD-323 can handle about 200mA. What the SOD-323 package when ordering, there are some mfgs out there that are 5-pin packages.
F1 F2 = SparkFun:FUSE
IC1 = 74xx-us:74*14: Hex schmitt trigger INVERTER
IC2 IC3 = PowerBoard:MAX9938: MAX9938 Maxim 1μA, 4-Bump UCSP/SOT23, Precision Current-Sense Amplifier Source: http://datasheets.maxim-ic.com/en/ds/MAX9938.pdf
IC4 = rbg-richtek-vreg:RT7247A
IC5 = v-reg-3:LM1117
IC6 = rbg-ti-currentsense:LMP8480
IC7 = linear:MCP601: Single Op Amp 2.7V to 6.0V Single Supply CMOS Source: http://ww1.microchip.com/downloads/en/DeviceDoc/21314g.pdf
IC8 = 74xx-us:74*595: 8-bit SHIFT REGISTER, output latch
IC9 IC10 = 74xx-us:74*165: 8-bit parallel load SHIFT REGISTER
IC11 = lpc1100v1.1:LPC11C22/24-LQFP48: NXP Semiconductors LPC11Cxx microcontrollers <http://ics.nxp.com/products/lpc1000/lpc11xx/lpc11cxx/> ARM 32-bit Cortex-M0 Microcontroller with MPU CPU clock up to 50MHz 32KByte on-chip Flash ROM with In-System Programming (ISP) and In-Application Programming (IAP) via On-Chip Bootloader 8KByte SRAM Nested Vectored Interrupt Controller 2 SPI controllers CAN controller On-chip, high-speed CAN transciever UART with full Modem Interface and RS485 Support Fast Mode I2C-Bus 4 Timers with 4 capture channels and 12 output channels Watchdog (WDT) Sytem tick timer 10-bit ADC with 8 channels Power Management Unit (PMU) Brownout detection 12MHz internal RC oscillator Serial Wire Debug/Trace port
JTAG1 = microbuilder:JTAG-CORTEXM3: Serial Wire (SW-DP) Connector This standard 0.05" 10-pin connector is for use with the Cortex M0/M3's native SWD (serial wire debugger) interface (SW-DP). Some boards support a 20-pin combined JTAG+SWD connector (SWJ-DP), such as the LPC1700 family, but many smaller devices only work with SWD which typically use the smaller 10-pin SW-DP connecter (the LPC1300 family, for example, only supports SWD). 2x05 1.27mm/0.05" Connector: This is the standard SMT connector defined by ARM for all Cortex devices, and should be used in most situations and for forward-compatibility since any new devices coming to market will likely use this connector. MOLEX 10 Pin 0.1" Connector: This 0.1" 10 pin connector has the same pin layout as the standard 0.05" connector, but is easier to work with if you are using standard jumper wires or custom cables to connect your SWD hardware. MOLEX 20 Pin 0.1" Connector: This 0.1" 20 pin connector is the same model used for ARM7/ARM9 JTAG debuggers, but is connected to match the pins on the Segger J-Link for ARM (which supports both JTAG and SWD debugging). See the following document from ARM for more information on Cortex M3 Debug Connectors: http://infocenter.arm.com/help/topic/com.arm.doc.faqs/attached/13634/cortex_debug_connectors.pdf And the following page for an overview with images of the different connector types: http://www.keil.com/peripherals/coresight/connectors.asp
L1 = inductors:DR1030: DR1030 Series Low Profile Power Inductors Source: Data sheet <http://www.cooperbussmann.com/pdf/c73e479f-f867-4c64-ae26-9c1f23814163.pdf>
LED1-LED14 = led:LED: LED OSRAM: - CHIPLED LG R971, LG N971, LY N971, LG Q971, LY Q971, LO R971, LY R971 LH N974, LH R974 LS Q976, LO Q976, LY Q976 LO Q996 - Hyper CHIPLED LW Q18S LB Q993, LB Q99A, LB R99A - SideLED LS A670, LO A670, LY A670, LG A670, LP A670 LB A673, LV A673, LT A673, LW A673 LH A674 LY A675 LS A676, LA A676, LO A676, LY A676, LW A676 LS A679, LY A679, LG A679 - Hyper Micro SIDELED® LS Y876, LA Y876, LO Y876, LY Y876 LT Y87S - SmartLED LW L88C, LW L88S LB L89C, LB L89S, LG L890 LS L89K, LO L89K, LY L89K LS L896, LA L896, LO L896, LY L896 - TOPLED LS T670, LO T670, LY T670, LG T670, LP T670 LSG T670, LSP T670, LSY T670, LOP T670, LYG T670 LG T671, LOG T671, LSG T671 LB T673, LV T673, LT T673, LW T673 LH T674 LS T676, LA T676, LO T676, LY T676, LB T676, LH T676, LSB T676, LW T676 LB T67C, LV T67C, LT T67C, LS T67K, LO T67K, LY T67K, LW E67C LS E67B, LA E67B, LO E67B, LY E67B, LB E67C, LV E67C, LT E67C LW T67C LS T679, LY T679, LG T679 LS T770, LO T770, LY T770, LG T770, LP T770 LB T773, LV T773, LT T773, LW T773 LH T774 LS E675, LA E675, LY E675, LS T675 LS T776, LA T776, LO T776, LY T776, LB T776 LHGB T686 LT T68C, LB T68C - Hyper Mini TOPLED® LB M676 - Mini TOPLED Santana® LG M470 LS M47K, LO M47K, LY M47K Source: http://www.osram.convergy.de LUXEON: - LUMILED® LXK2-PW12-R00, LXK2-PW12-S00, LXK2-PW14-U00, LXK2-PW14-V00 LXK2-PM12-R00, LXK2-PM12-S00, LXK2-PM14-U00 LXK2-PE12-Q00, LXK2-PE12-R00, LXK2-PE12-S00, LXK2-PE14-T00, LXK2-PE14-U00 LXK2-PB12-K00, LXK2-PB12-L00, LXK2-PB12-M00, LXK2-PB14-N00, LXK2-PB14-P00, LXK2-PB14-Q00 LXK2-PR12-L00, LXK2-PR12-M00, LXK2-PR14-Q00, LXK2-PR14-R00 LXK2-PD12-Q00, LXK2-PD12-R00, LXK2-PD12-S00 LXK2-PH12-R00, LXK2-PH12-S00 LXK2-PL12-P00, LXK2-PL12-Q00, LXK2-PL12-R00 Source: www.luxeon.com KINGBRIGHT: KA-3528ASYC Source: www.kingbright.com
PL1 PL2 = con-molex-2:555X-16: Mini FIT connector 16 way
PL3 PL4 = con-molex-2:555X-8: Mini FIT connector 8 way
Q1 = crystal:CRYSTAL: CRYSTAL; OC_FARNELL: unknown; OC_NEWARK: unknown
QQ1 QQ2 QQ5-QQ8 = transistors:IRF8910: International Rectifier IRF8910, 9910 Dual MOSFET in SO-8, standard pinout
QQ3 QQ4 = transistors:IRF9362
R1-R58 = rcl:R-US_: RESISTOR, American symbol
RN1-RN19 = resistor-dil:4R-N: Array Chip Resistor Source: RS Component / Phycomp; OC_FARNELL: unknown; OC_NEWARK: unknown
S1 S2 = switch-dil:DS08: DIL/CODE SWITCH; MPN: DS08; OC_FARNELL: unknown; OC_NEWARK: 73J0071
T1-T20 = transistor:*-NPN-: NPN Transistror BF959 corrected 2008.03.06
X1-X4 = con-molex:22-23-2081: .100" (2.54mm) Center Header - 8 Pin; MF: MOLEX; MPN: 22-23-2081; OC_FARNELL: 1756826; OC_NEWARK: 01C7592
X5 = con-molex:43160-*05: SDA-43160 Connector Source: http://www.molex.com/pdm_docs/sd/431601306_sd.pdf; MF: WALDOM/MOLEX; MPN: 43160-3105; OC_FARNELL: unknown; OC_NEWARK: 54H0267
X6 = con-tycoelectronics:RJ45: CORCOM Modular RJ Jacks No Shield Source: www.tycoelectronics.com .. ENG_DS_1654001_1099_RJ_L_0507.pdf; MPN: RJ45-8X; OC_FARNELL: unknown; OC_NEWARK: 16R6101
X7 = rbg-ftdi-usb:TTL-232R-5V
X8 = rbg-generic-headers:M09-100MIL
X9 = con-molex:22-23-2041: .100" (2.54mm) Center Header - 4 Pin; MF: MOLEX; MPN: 22-23-2041; OC_FARNELL: 1462920; OC_NEWARK: 38C0355